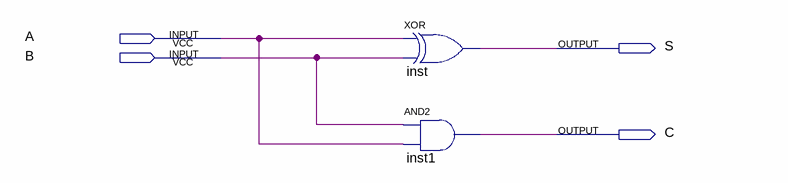
[diagram p0: schematic sheet]
// Quartus schematic half_adder_top.bdf as structural Verilog: 2 symbols, 4 pins
module half_adder_top (
  input  A,
  input  B,
  output S,
  output C
);

  xor inst (S, A, B);
  and inst1 (C, B, A);
endmodule
